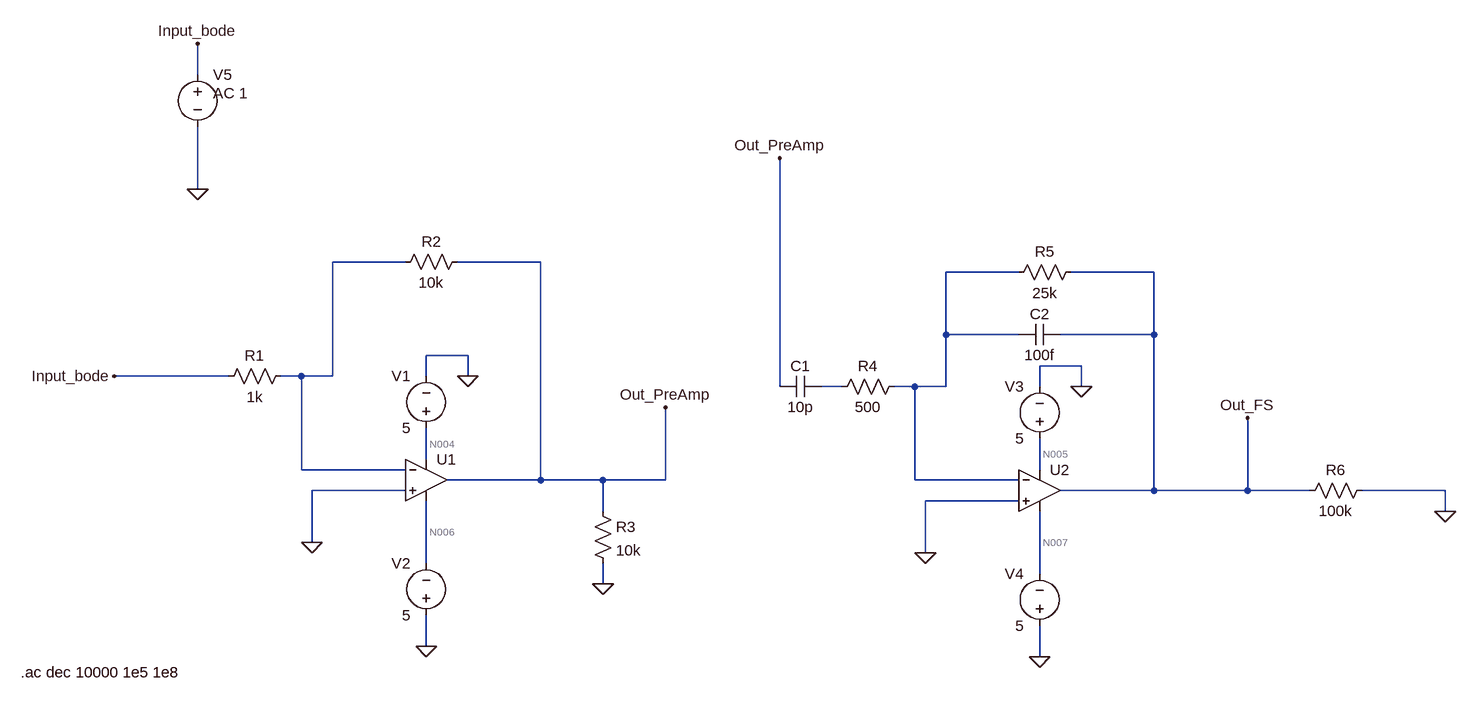
[diagram p0: schematic Bode_Full_Chain.asc]
Bode_Full_Chain.asc, the LTspice schematic file:
Version 4
SHEET 1 2020 776
WIRE -256 -160 -256 -208
WIRE -256 16 -256 -80
WIRE 64 128 -48 128
WIRE 272 128 144 128
WIRE 1008 144 896 144
WIRE 1216 144 1088 144
WIRE 896 240 896 144
WIRE 1008 240 896 240
WIRE 1216 240 1216 144
WIRE 1216 240 1072 240
WIRE 160 272 96 272
WIRE 1104 288 1040 288
WIRE -208 304 -384 304
WIRE -96 304 -128 304
WIRE -48 304 -48 128
WIRE -48 304 -96 304
WIRE 96 304 96 272
WIRE 160 304 160 272
WIRE 640 320 640 -32
WIRE 736 320 704 320
WIRE 848 320 816 320
WIRE 896 320 896 240
WIRE 896 320 848 320
WIRE 1040 320 1040 288
WIRE 1104 320 1104 288
WIRE 96 432 96 384
WIRE -96 448 -96 304
WIRE 64 448 -96 448
WIRE 1040 448 1040 400
WIRE 272 464 272 128
WIRE 272 464 128 464
WIRE 368 464 272 464
WIRE 464 464 464 352
WIRE 464 464 368 464
WIRE 848 464 848 320
WIRE 1008 464 848 464
WIRE 64 480 -80 480
WIRE 1216 480 1216 240
WIRE 1216 480 1072 480
WIRE 1360 480 1360 368
WIRE 1360 480 1216 480
WIRE 1456 480 1360 480
WIRE 1664 480 1536 480
WIRE 1008 496 864 496
WIRE 368 512 368 464
WIRE 1664 512 1664 480
WIRE -80 560 -80 480
WIRE 864 576 864 496
WIRE 96 592 96 496
WIRE 1040 608 1040 512
WIRE 368 624 368 592
WIRE 96 720 96 672
WIRE 1040 736 1040 688
FLAG 96 720 0
FLAG 160 304 0
FLAG -80 560 0
FLAG 464 352 Out_PreAmp
FLAG -384 304 Input_bode
FLAG 368 624 0
FLAG 1040 736 0
FLAG 1104 320 0
FLAG 864 576 0
FLAG 1360 368 Out_FS
FLAG 1664 512 0
FLAG 640 -32 Out_PreAmp
FLAG -256 16 0
FLAG -256 -208 Input_bode
SYMBOL res -112 288 R90
WINDOW 0 0 56 VBottom 2
WINDOW 3 32 56 VTop 2
SYMATTR InstName R1
SYMATTR Value 1k
SYMBOL res 160 112 R90
WINDOW 0 0 56 VBottom 2
WINDOW 3 32 56 VTop 2
SYMATTR InstName R2
SYMATTR Value 10k
SYMBOL voltage 96 400 R180
WINDOW 0 24 96 Left 2
WINDOW 3 24 16 Left 2
WINDOW 123 0 0 Left 0
WINDOW 39 0 0 Left 0
SYMATTR InstName V1
SYMATTR Value 5
SYMBOL voltage 96 688 R180
WINDOW 0 24 96 Left 2
WINDOW 3 24 16 Left 2
WINDOW 123 0 0 Left 0
WINDOW 39 0 0 Left 0
SYMATTR InstName V2
SYMATTR Value 5
SYMBOL OpAmps\\UniversalOpAmp1 96 464 R0
SYMATTR InstName U1
SYMATTR Value2 Avol=1Meg GBW=100Meg Vos=0
SYMBOL res 352 496 R0
SYMATTR InstName R3
SYMATTR Value 10k
SYMBOL res 832 304 R90
WINDOW 0 0 56 VBottom 2
WINDOW 3 32 56 VTop 2
SYMATTR InstName R4
SYMATTR Value 500
SYMBOL res 1104 128 R90
WINDOW 0 0 56 VBottom 2
WINDOW 3 32 56 VTop 2
SYMATTR InstName R5
SYMATTR Value 25k
SYMBOL voltage 1040 416 R180
WINDOW 0 24 96 Left 2
WINDOW 3 24 16 Left 2
WINDOW 123 0 0 Left 0
WINDOW 39 0 0 Left 0
SYMATTR InstName V3
SYMATTR Value 5
SYMBOL voltage 1040 704 R180
WINDOW 0 24 96 Left 2
WINDOW 3 24 16 Left 2
WINDOW 123 0 0 Left 0
WINDOW 39 0 0 Left 0
SYMATTR InstName V4
SYMATTR Value 5
SYMBOL OpAmps\\UniversalOpAmp1 1040 480 R0
SYMATTR InstName U2
SYMATTR Value2 Avol=1Meg GBW=800Meg Vos=0
SYMBOL res 1552 464 R90
WINDOW 0 0 56 VBottom 2
WINDOW 3 32 56 VTop 2
SYMATTR InstName R6
SYMATTR Value 100k
SYMBOL cap 704 304 R90
WINDOW 0 0 32 VBottom 2
WINDOW 3 32 32 VTop 2
SYMATTR InstName C1
SYMATTR Value 10p
SYMBOL cap 1072 224 R90
WINDOW 0 0 32 VBottom 2
WINDOW 3 32 32 VTop 2
SYMATTR InstName C2
SYMATTR Value 100f
SYMBOL voltage -256 -176 R0
WINDOW 123 24 44 Left 2
WINDOW 39 0 0 Left 0
SYMATTR InstName V5
SYMATTR Value ""
SYMATTR Value2 AC 1
TEXT -528 760 Left 2 !.ac dec 10000 1e5 1e8

The netlist it stands for:
* Bode_Full_Chain.asc
R1 N001 Input_bode 1k
R2 Out_PreAmp N001 10k
V1 N004 0 5
V2 0 N006 5
XU1 0 N001 N004 N006 Out_PreAmp level1 Avol=1Meg GBW=100Meg Vos=0 En=0 Enk=0 In=0 Ink=0 Rin=500Meg  ; pins In+ In- V+ V- OUT
R3 Out_PreAmp 0 10k
R4 N002 N003 500
R5 Out_FS N002 25k
V3 N005 0 5
V4 0 N007 5
XU2 0 N002 N005 N007 Out_FS level1 Avol=1Meg GBW=800Meg Vos=0 En=0 Enk=0 In=0 Ink=0 Rin=500Meg  ; pins In+ In- V+ V- OUT
R6 0 Out_FS 100k
C1 N003 Out_PreAmp 10p
C2 Out_FS N002 100f
V5 Input_bode 0 AC 1
.ac dec 10000 1e5 1e8
.lib UniversalOpAmp1.lib
.backanno
.end

* Results of the author's LTspice run, read from the files saved beside the schematic
* Operating Point, zero values left out:
*   V(n004) = 5 V
*   V(n006) = -5 V
*   V(n005) = 5 V
*   V(n007) = -5 V
*   I(V1) = -10 nA
*   I(V2) = -10 nA
*   I(V3) = -10 nA
*   I(V4) = -10 nA
*   Ix(u1:3) = 10 nA
*   Ix(u1:4) = -10 nA
*   Ix(u2:3) = 10 nA
*   Ix(u2:4) = -10 nA